# Altium project BatteryBd.PrjPCB
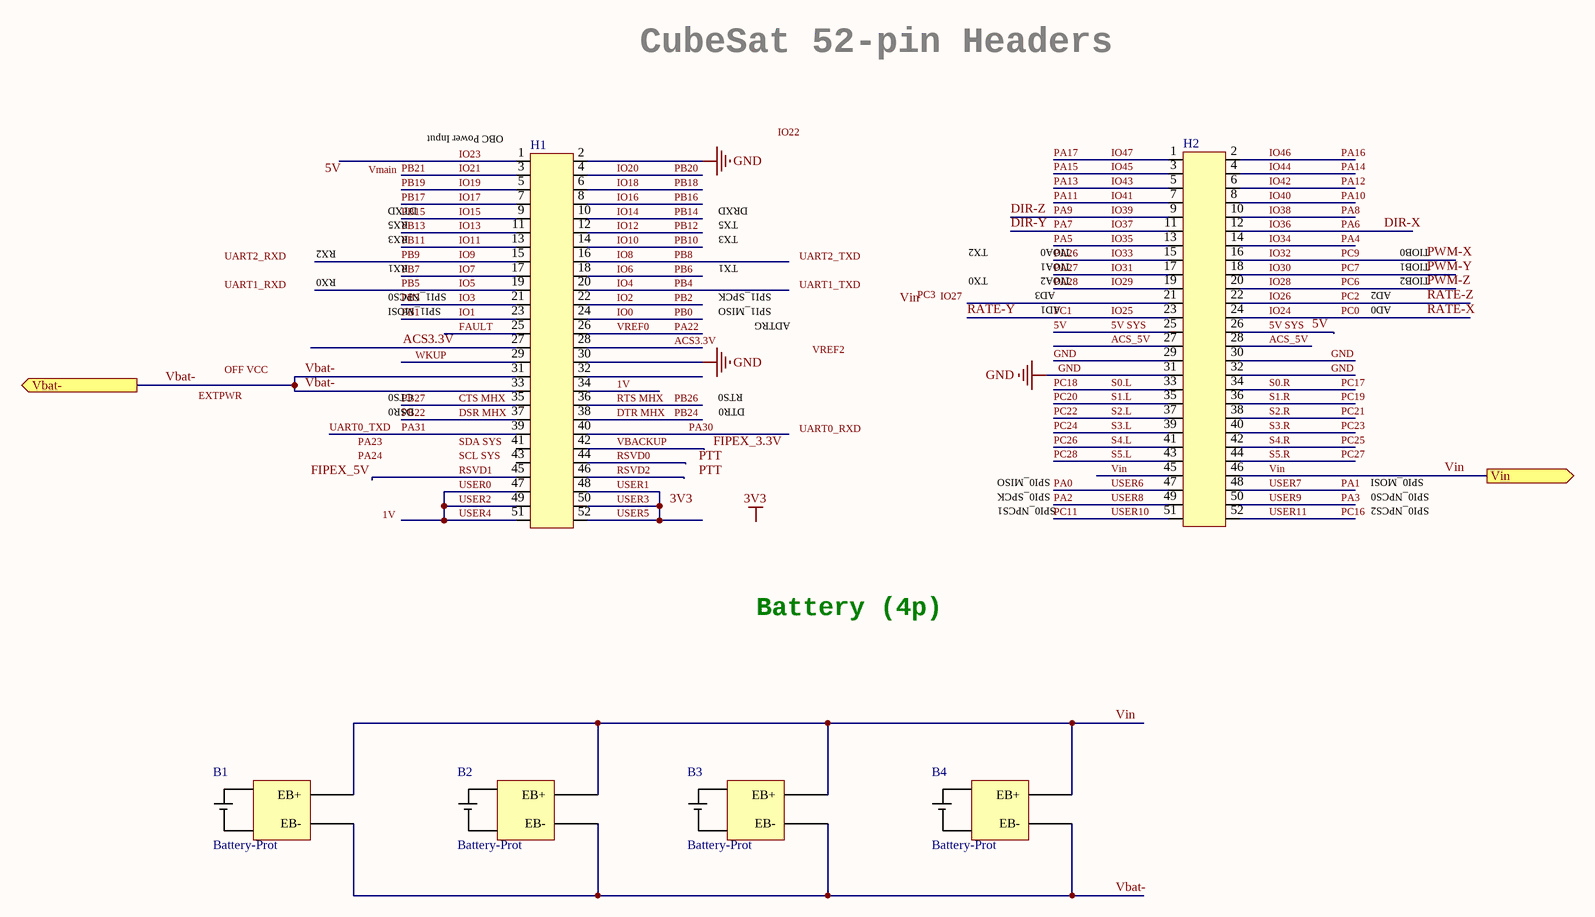
[diagram p0: Battery4p.SchDoc]
1 sheet, 6 parts. Net scope: flat (ports and power ports of the same name join across sheets).
Board file: PCB1.PcbDoc

## Sheet Battery4p.SchDoc
size A3

### Parts
B1  Battery-Prot  [Batt-Prot]
B2  Battery-Prot  [Batt-Prot]
B3  Battery-Prot  [Batt-Prot]
B4  Battery-Prot  [Batt-Prot]
H1  H?  [SAMTEC_ESQ_126_39_G_D]  (value not drawn)
H2  H?  [SAMTEC_ESQ_126_39_G_D]  (value not drawn)

### Ports
Vbat- (out), Vin (out)

### Nets
GND: H1.2 H1.30 H2.29 H2.30 H2.31 H2.32
1V: H1.34
5V: H2.25 H2.26  [also labelled 5V SYS]
ACS3.3V: H1.27 H1.28
ACS_5V: H2.27 H2.28
CTS MHX: H1.35  [also labelled PB27]
DIR-X: H2.12  [also labelled IO36, PA6]
DIR-Y: H2.11  [also labelled IO37, PA7]
DIR-Z: H2.9  [also labelled IO39, PA9]
DSR MHX: H1.37  [also labelled PB22]
DTR MHX: H1.38  [also labelled PB24]
FAULT: H1.25
IO0: H1.24  [also labelled PB0]
IO1: H1.23  [also labelled PB1]
IO2: H1.22  [also labelled PB2]
IO3: H1.21  [also labelled PB3]
IO4: H1.20  [also labelled PB4]
IO5: H1.19  [also labelled PB5]
IO6: H1.18  [also labelled PB6]
IO7: H1.17  [also labelled PB7]
IO8: H1.16  [also labelled PB8]
IO9: H1.15  [also labelled PB9]
IO10: H1.14  [also labelled PB10]
IO11: H1.13  [also labelled PB11]
IO12: H1.12  [also labelled PB12]
IO13: H1.11  [also labelled PB13]
IO14: H1.10  [also labelled PB14]
IO15: H1.9  [also labelled PB15]
IO16: H1.8  [also labelled PB16]
IO17: H1.7  [also labelled PB17]
IO18: H1.6  [also labelled PB18]
IO19: H1.5  [also labelled PB19]
IO20: H1.4  [also labelled PB20]
IO21: H1.3  [also labelled PB21]
IO23: H1.1
IO24: H2.24  [also labelled PC0, RATE-X]
IO25: H2.23  [also labelled PC1, RATE-Y]
IO26: H2.22  [also labelled PC2, RATE-Z]
IO28: H2.20  [also labelled PC6, PWM-Z]
IO29: H2.19  [also labelled PA28]
IO30: H2.18  [also labelled PC7, PWM-Y]
IO31: H2.17  [also labelled PA27]
IO32: H2.16  [also labelled PC9, PWM-X]
IO33: H2.15  [also labelled PA26]
IO34: H2.14  [also labelled PA4]
IO35: H2.13  [also labelled PA5]
IO38: H2.10  [also labelled PA8]
IO40: H2.8  [also labelled PA10]
IO41: H2.7  [also labelled PA11]
IO42: H2.6  [also labelled PA12]
IO43: H2.5  [also labelled PA13]
IO44: H2.4  [also labelled PA14]
IO45: H2.3  [also labelled PA15]
IO46: H2.2  [also labelled PA16]
IO47: H2.1  [also labelled PA17]
PA0: H2.47  [also labelled USER6]
PA1: H2.48  [also labelled USER7]
PA2: H2.49  [also labelled USER8]
PA3: H2.50  [also labelled USER9]
PA22: H1.26  [also labelled VREF0]
PA30: H1.40
PA31: H1.39  [also labelled UART0_TXD]
PB26: H1.36  [also labelled RTS MHX]
PC11: H2.51  [also labelled USER10]
PC16: H2.52  [also labelled USER11]
PC17: H2.34  [also labelled S0.R]
PC18: H2.33  [also labelled S0.L]
PC19: H2.36  [also labelled S1.R]
PC20: H2.35  [also labelled S1.L]
PC21: H2.38  [also labelled S2.R]
PC22: H2.37  [also labelled S2.L]
PC23: H2.40  [also labelled S3.R]
PC24: H2.39  [also labelled S3.L]
PC25: H2.42  [also labelled S4.R]
PC26: H2.41  [also labelled S4.L]
PC27: H2.44  [also labelled S5.R]
PC28: H2.43  [also labelled S5.L]
RSVD0: H1.44
RSVD1: H1.45
RSVD2: H1.46
USER0: H1.47 H1.49 H1.51  [also labelled USER2, USER4]
USER1: H1.48 H1.50 H1.52  [also labelled USER3, USER5]
VBACKUP: H1.42
Vbat-: B1.EB- B2.EB- B3.EB- B4.EB- H1.31 H1.33 ; port Vbat-
Vin: B1.EB+ B2.EB+ B3.EB+ B4.EB+ H2.45 H2.46 ; port Vin
WKUP: H1.29

Not connected (* = marked no-connect by the designer): H1 32 41 43; H2 21

### Notes on the sheet
- CubeSat 52-pin Headers
- OBC Power Input
- RX2
- RX3
- RX5
- DTXD
- TX3
- TX5
- DRXD
- TX2
- TIOA0
- TIOB0
- RX0
- RX1
- SPI1_NPCS0
- SPI1_MOSI
- TX1
- SPI1_SPCK
- SPI1_MISO
- ADTRG
- TX0
- AD3
- AD1
- TIOA1
- TIOA2
- AD0
- AD2
- TIOB1
- TIOB2
- CTS0
- RTS0
- DSR0
- DTR0
- SPI0_MISO
- SPI0_SPCK
- SPI0_NPCS1
- SPI0_MOSI
- SPI0_NPCS0
- SPI0_NPCS2
- Battery (4p)
- Labels drawn without touching a wire or pin: 1V, 3V3, 5V, EXTPWR, FIPEX_3.3V, FIPEX_5V, IO22, IO27, OFF VCC, PA23, PA24, PC3, PTT, SCL SYS, SDA SYS, UART0_RXD, UART1_RXD, UART1_TXD, UART2_RXD, UART2_TXD, Vin, Vmain, VREF2

### Library data of the parts
H1 H2 = SAMTEC_ESQ_126_39_G_D: 26X2 header